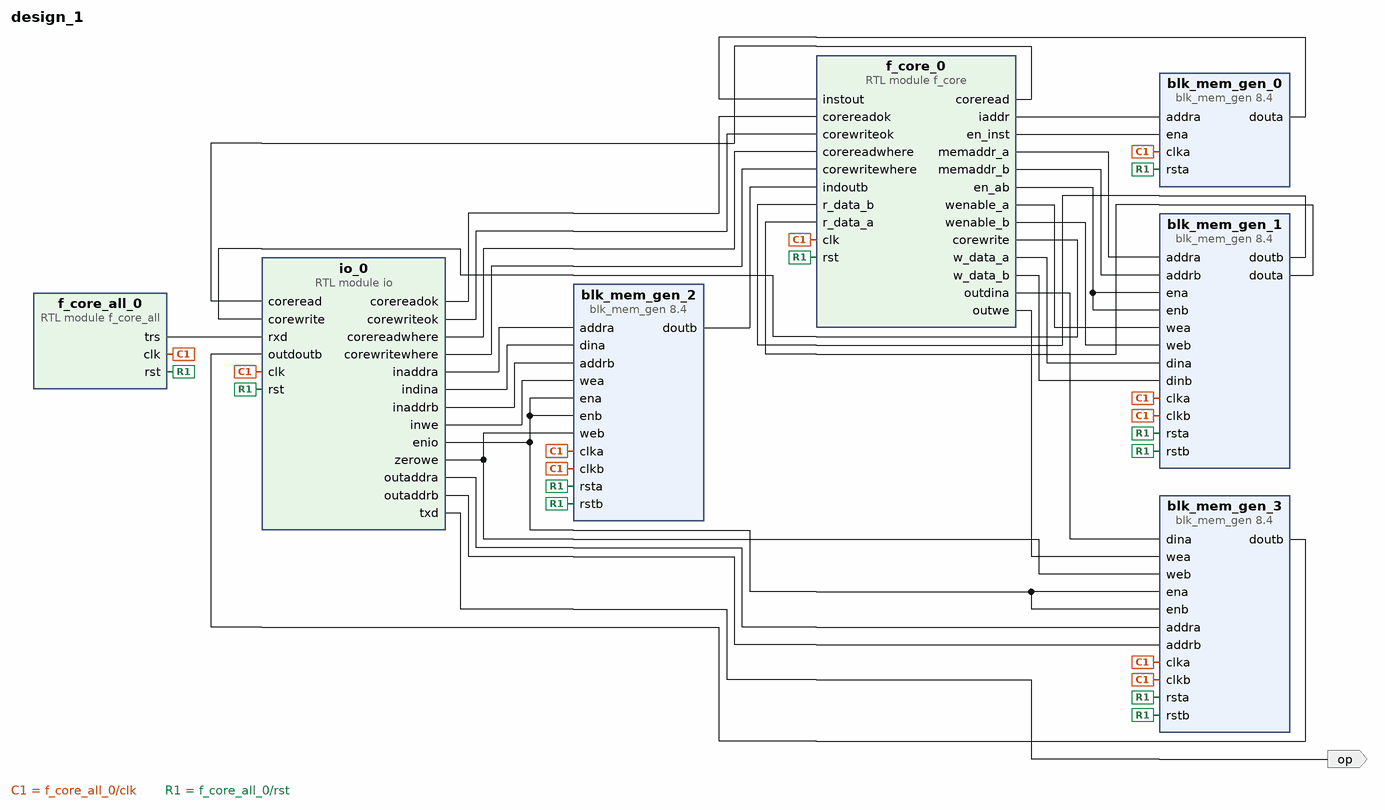
[diagram p0: block diagram of the top level]
# Vivado block design design_1, xcku040-ffva1156-2-e, Vivado 2017.4
create_bd_design design_1

create_bd_port -dir O op

create_bd_cell -type ip -vlnv xilinx.com:ip:blk_mem_gen:8.4 blk_mem_gen_0
set_property -dict [list \
  CONFIG.Memory_Type Single_Port_ROM \
  CONFIG.Load_Init_File true \
  CONFIG.Coe_File ../../../../../../../inst.coe \
  CONFIG.Port_A_Write_Rate 0 \
  CONFIG.EN_SAFETY_CKT false \
] [get_bd_cells blk_mem_gen_0]
create_bd_cell -type ip -vlnv xilinx.com:ip:blk_mem_gen:8.4 blk_mem_gen_1
set_property -dict [list \
  CONFIG.Memory_Type True_Dual_Port_RAM \
  CONFIG.Assume_Synchronous_Clk true \
  CONFIG.Enable_B Use_ENB_Pin \
  CONFIG.Use_RSTB_Pin true \
  CONFIG.Port_B_Clock 100 \
  CONFIG.Port_B_Write_Rate 50 \
  CONFIG.Port_B_Enable_Rate 100 \
  CONFIG.EN_SAFETY_CKT false \
] [get_bd_cells blk_mem_gen_1]
create_bd_cell -type ip -vlnv xilinx.com:ip:blk_mem_gen:8.4 blk_mem_gen_2
set_property -dict [list \
  CONFIG.Memory_Type True_Dual_Port_RAM \
  CONFIG.EN_SLEEP_PIN false \
  CONFIG.Assume_Synchronous_Clk true \
  CONFIG.Enable_B Use_ENB_Pin \
  CONFIG.Use_RSTB_Pin true \
  CONFIG.Port_B_Clock 100 \
  CONFIG.Port_B_Write_Rate 50 \
  CONFIG.Port_B_Enable_Rate 100 \
  CONFIG.EN_SAFETY_CKT false \
] [get_bd_cells blk_mem_gen_2]
create_bd_cell -type ip -vlnv xilinx.com:ip:blk_mem_gen:8.4 blk_mem_gen_3
set_property -dict [list \
  CONFIG.Memory_Type True_Dual_Port_RAM \
  CONFIG.Assume_Synchronous_Clk true \
  CONFIG.Enable_B Use_ENB_Pin \
  CONFIG.Use_RSTB_Pin true \
  CONFIG.Port_B_Clock 100 \
  CONFIG.Port_B_Write_Rate 50 \
  CONFIG.Port_B_Enable_Rate 100 \
  CONFIG.EN_SAFETY_CKT false \
] [get_bd_cells blk_mem_gen_3]
create_bd_cell -type module -reference f_core f_core_0
create_bd_cell -type module -reference f_core_all f_core_all_0
create_bd_cell -type module -reference io io_0

# ---- connections ----

connect_bd_net [get_bd_pins f_core_all_0/clk] \
  [get_bd_pins blk_mem_gen_0/clka] [get_bd_pins blk_mem_gen_1/clka] [get_bd_pins blk_mem_gen_1/clkb] \
  [get_bd_pins blk_mem_gen_2/clka] [get_bd_pins blk_mem_gen_2/clkb] [get_bd_pins blk_mem_gen_3/clka] \
  [get_bd_pins blk_mem_gen_3/clkb] [get_bd_pins f_core_0/clk] [get_bd_pins io_0/clk]
connect_bd_net [get_bd_pins f_core_all_0/rst] \
  [get_bd_pins blk_mem_gen_0/rsta] [get_bd_pins blk_mem_gen_1/rstb] [get_bd_pins blk_mem_gen_1/rsta] \
  [get_bd_pins blk_mem_gen_2/rstb] [get_bd_pins blk_mem_gen_2/rsta] [get_bd_pins blk_mem_gen_3/rsta] \
  [get_bd_pins blk_mem_gen_3/rstb] [get_bd_pins f_core_0/rst] [get_bd_pins io_0/rst]
connect_bd_net [get_bd_pins f_core_all_0/trs] [get_bd_pins io_0/rxd]
connect_bd_net [get_bd_pins f_core_0/iaddr] [get_bd_pins blk_mem_gen_0/addra]
connect_bd_net [get_bd_pins blk_mem_gen_0/douta] [get_bd_pins f_core_0/instout]
connect_bd_net [get_bd_pins f_core_0/en_inst] [get_bd_pins blk_mem_gen_0/ena]
connect_bd_net [get_bd_pins f_core_0/memaddr_a] [get_bd_pins blk_mem_gen_1/addra]
connect_bd_net [get_bd_pins f_core_0/memaddr_b] [get_bd_pins blk_mem_gen_1/addrb]
connect_bd_net [get_bd_pins f_core_0/en_ab] [get_bd_pins blk_mem_gen_1/ena] [get_bd_pins blk_mem_gen_1/enb]
connect_bd_net [get_bd_pins f_core_0/wenable_a] [get_bd_pins blk_mem_gen_1/wea]
connect_bd_net [get_bd_pins f_core_0/wenable_b] [get_bd_pins blk_mem_gen_1/web]
connect_bd_net [get_bd_pins blk_mem_gen_1/doutb] [get_bd_pins f_core_0/r_data_b]
connect_bd_net [get_bd_pins blk_mem_gen_1/douta] [get_bd_pins f_core_0/r_data_a]
connect_bd_net [get_bd_pins f_core_0/w_data_a] [get_bd_pins blk_mem_gen_1/dina]
connect_bd_net [get_bd_pins f_core_0/w_data_b] [get_bd_pins blk_mem_gen_1/dinb]
connect_bd_net [get_bd_pins io_0/corereadok] [get_bd_pins f_core_0/corereadok]
connect_bd_net [get_bd_pins io_0/corewriteok] [get_bd_pins f_core_0/corewriteok]
connect_bd_net [get_bd_pins io_0/corereadwhere] [get_bd_pins f_core_0/corereadwhere]
connect_bd_net [get_bd_pins io_0/corewritewhere] [get_bd_pins f_core_0/corewritewhere]
connect_bd_net [get_bd_pins blk_mem_gen_2/doutb] [get_bd_pins f_core_0/indoutb]
connect_bd_net [get_bd_pins f_core_0/coreread] [get_bd_pins io_0/coreread]
connect_bd_net [get_bd_pins f_core_0/corewrite] [get_bd_pins io_0/corewrite]
connect_bd_net [get_bd_pins io_0/inaddra] [get_bd_pins blk_mem_gen_2/addra]
connect_bd_net [get_bd_pins io_0/indina] [get_bd_pins blk_mem_gen_2/dina]
connect_bd_net [get_bd_pins io_0/txd] [get_bd_ports op]
connect_bd_net [get_bd_pins io_0/inaddrb] [get_bd_pins blk_mem_gen_2/addrb]
connect_bd_net [get_bd_pins io_0/zerowe] [get_bd_pins blk_mem_gen_2/web] [get_bd_pins blk_mem_gen_3/web]
connect_bd_net [get_bd_pins io_0/outaddra] [get_bd_pins blk_mem_gen_3/addra]
connect_bd_net [get_bd_pins f_core_0/outdina] [get_bd_pins blk_mem_gen_3/dina]
connect_bd_net [get_bd_pins io_0/enio] \
  [get_bd_pins blk_mem_gen_2/ena] [get_bd_pins blk_mem_gen_2/enb] [get_bd_pins blk_mem_gen_3/enb] \
  [get_bd_pins blk_mem_gen_3/ena]
connect_bd_net [get_bd_pins io_0/inwe] [get_bd_pins blk_mem_gen_2/wea]
connect_bd_net [get_bd_pins f_core_0/outwe] [get_bd_pins blk_mem_gen_3/wea]
connect_bd_net [get_bd_pins io_0/outaddrb] [get_bd_pins blk_mem_gen_3/addrb]
connect_bd_net [get_bd_pins blk_mem_gen_3/doutb] [get_bd_pins io_0/outdoutb]

validate_bd_design
save_bd_design
